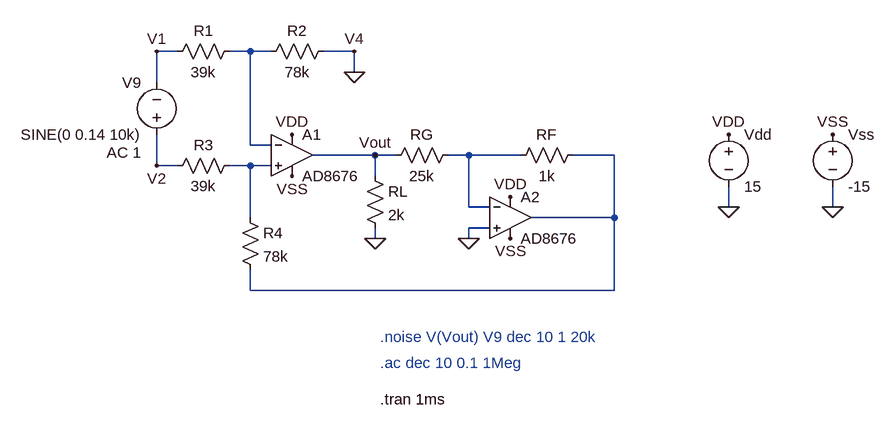
[diagram p0: schematic VGDA.asc]
VGDA.asc, the LTspice schematic file:
Version 4
SHEET 1 1384 680
WIRE -48 -32 -80 -32
WIRE 64 -32 32 -32
WIRE 96 -32 64 -32
WIRE 224 -32 176 -32
WIRE 224 0 224 -32
WIRE -80 16 -80 -32
WIRE 64 112 64 -32
WIRE 96 112 64 112
WIRE 256 128 160 128
WIRE 288 128 256 128
WIRE 400 128 368 128
WIRE 480 128 400 128
WIRE 624 128 560 128
WIRE -80 144 -80 96
WIRE -48 144 -80 144
WIRE 64 144 32 144
WIRE 96 144 64 144
WIRE 256 160 256 128
WIRE 400 208 400 128
WIRE 432 208 400 208
WIRE 800 208 800 176
WIRE 960 208 960 176
WIRE 64 224 64 144
WIRE 624 224 624 128
WIRE 624 224 496 224
WIRE 432 240 400 240
WIRE 256 256 256 240
WIRE 400 256 400 240
WIRE 64 336 64 304
WIRE 624 336 624 224
WIRE 624 336 64 336
FLAG 400 256 0
FLAG 224 0 0
FLAG 800 208 0
FLAG 960 208 0
FLAG 800 96 VDD
FLAG 128 96 VDD
FLAG 464 192 VDD
FLAG 960 96 VSS
FLAG 464 256 VSS
FLAG 128 160 VSS
FLAG 224 -32 V4
FLAG 256 256 0
FLAG 256 128 Vout
FLAG -80 144 V2
FLAG -80 -32 V1
SYMBOL OpAmps\\AD8676 464 160 R0
SYMATTR InstName A2
SYMBOL res 384 112 R90
WINDOW 0 0 56 VBottom 2
WINDOW 3 32 56 VTop 2
SYMATTR InstName RG
SYMATTR Value 25k
SYMBOL res 576 112 R90
WINDOW 0 0 56 VBottom 2
WINDOW 3 32 56 VTop 2
SYMATTR InstName RF
SYMATTR Value 1k
SYMBOL OpAmps\\AD8676 128 64 R0
SYMATTR InstName A1
SYMBOL res 48 208 R0
SYMATTR InstName R4
SYMATTR Value 78k
SYMBOL res 48 128 R90
WINDOW 0 0 56 VBottom 2
WINDOW 3 32 56 VTop 2
SYMATTR InstName R3
SYMATTR Value 39k
SYMBOL res 48 -48 R90
WINDOW 0 0 56 VBottom 2
WINDOW 3 32 56 VTop 2
SYMATTR InstName R1
SYMATTR Value 39k
SYMBOL res 192 -48 R90
WINDOW 0 0 56 VBottom 2
WINDOW 3 32 56 VTop 2
SYMATTR InstName R2
SYMATTR Value 78k
SYMBOL voltage 800 80 R0
WINDOW 123 0 0 Left 0
WINDOW 39 0 0 Left 0
SYMATTR InstName Vdd
SYMATTR Value 15
SYMBOL voltage 960 80 R0
WINDOW 123 0 0 Left 0
WINDOW 39 0 0 Left 0
SYMATTR InstName Vss
SYMATTR Value -15
SYMBOL voltage -80 112 R180
WINDOW 0 24 96 Left 2
WINDOW 3 24 16 Left 2
WINDOW 123 24 -12 Left 2
WINDOW 39 0 0 Left 0
SYMATTR InstName V9
SYMATTR Value SINE(0 0.14 10k)
SYMATTR Value2 AC 1
SYMBOL res 240 144 R0
SYMATTR InstName RL
SYMATTR Value 2k
TEXT 264 408 Left 2 ;.noise V(Vout) V9 dec 10 1 20k
TEXT 264 448 Left 2 ;.ac dec 10 0.1 1Meg
TEXT 264 504 Left 2 !.tran 1ms

The netlist it stands for:
* VGDA.asc
XA2 0 N002 VDD VSS N003 AD8676  ; pins In+ In- V+ V- OUT
RG N002 Vout 25k
RF N003 N002 1k
XA1 N004 N001 VDD VSS Vout AD8676  ; pins In+ In- V+ V- OUT
R4 N004 N003 78k
R3 N004 V2 39k
R1 N001 V1 39k
R2 0 N001 78k
Vdd VDD 0 15
Vss VSS 0 -15
V9 V2 V1 SINE(0 0.14 10k) AC 1
RL Vout 0 2k
* .noise V(Vout) V9 dec 10 1 20k
* .ac dec 10 0.1 1Meg
.tran 1ms
.backanno
.end